# Altium schematic sheet EVK-NORA-B2_SCHEM_0004_SWITCH_Memory.SchDoc
size A3; Date: 7/24/2020; CompanyName: U-blox; DrawnBy: EMOO; Engineer: EMOO; Organization: U-blox; Address1: 3950 Fairview Industrial Dr SE #100*; Address2: Salem, OR 97302; SheetNumber: 4; SheetTotal: 6; SheetSize: B; SheetTitle: Interface MCU
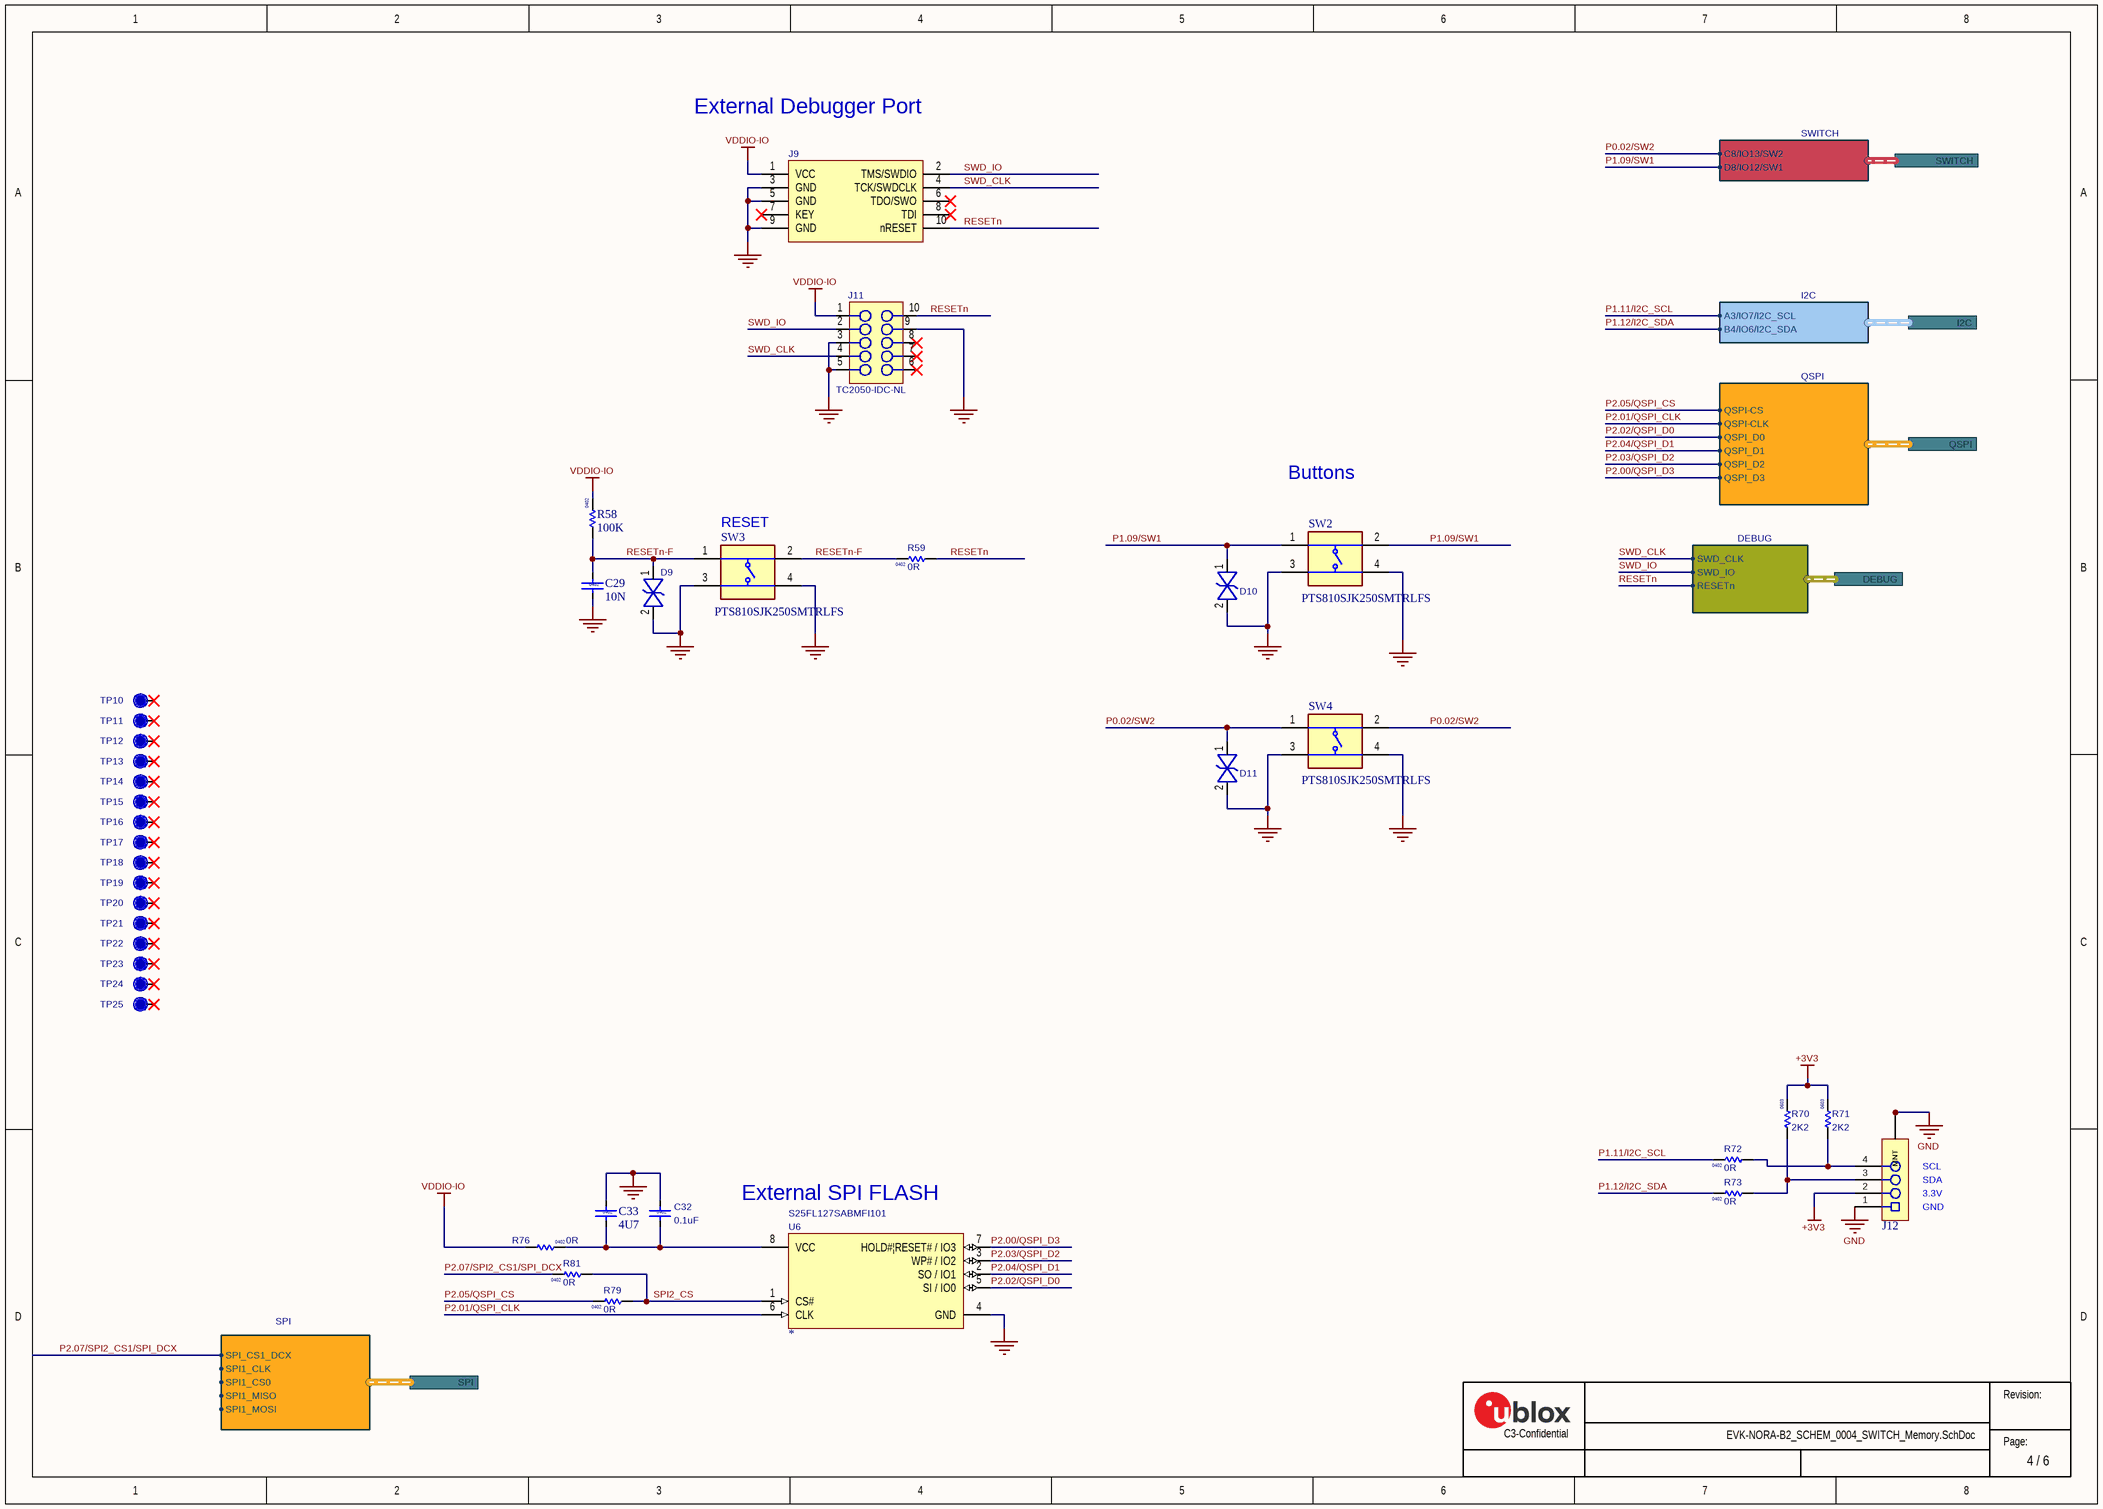
[diagram p0: EVK-NORA-B2_SCHEM_0004_SWITCH_Memory.SchDoc]

## Parts
C29  value 10N  Size: 0402  [Cap_0402_1100Lx600Wx600H_600x600Pad_350G_FLX]
C32  value 0.1uF  Size: 0402  [Cap 0402 HD]  (hidden comment: 120-000160.1uF)
C33  value 4U7  Size: 0402  [Cap 0402 HD]
D9  110-00019  [SOD-923]  (value not drawn)
D10  110-00019  [SOD-923]  (value not drawn)
D11  110-00019  [SOD-923]  (value not drawn)
J9  130-00099  [HDR.050P-10Pin-2x5-SMT_Key]  (value not drawn)
J11  TC2050-IDC-NLDNP  [TC2050-IDC-NL]  (value not drawn)  (no BOM)
J12  UBXH04-0000797  [SM04B-SRSS-TB]  (value not drawn)
R58  value 100K  Size: 0402  [RES_0402_1100Lx600Wx400H_500x600Pad_400G_FLX]
R59  value 0R  Size: 0402  [RES 0402 HD]
R70  value 2K2  Size: 0603  [RES_0603_1700Lx950Wx600H_600x1000Pad_800G_FLX]
R71  value 2K2  Size: 0603  [RES_0603_1700Lx950Wx600H_600x1000Pad_800G_FLX]
R72  value 0R  Size: 0402  [RES 0402 HD]
R73  value 0R  Size: 0402  [RES 0402 HD]
R76  value 0R  Size: 0402  [RES 0402 HD]
R79  value 0R  Size: 0402  [RES 0402 HD]
R81  value 0R  Size: 0402  [RES 0402 HD]
SW2  PTS810SJK250SMTRLFS  [PTS810SJG250SMTRLFS]
SW3  PTS810SJK250SMTRLFS  [PTS810SJG250SMTRLFS]
SW4  PTS810SJK250SMTRLFS  [PTS810SJG250SMTRLFS]
TP10  TP  [TP10R]  (value not drawn)  (no BOM)
TP11  TP  [TP10R]  (value not drawn)  (no BOM)
TP12  TP  [TP10R]  (value not drawn)  (no BOM)
TP13  TP  [TP10R]  (value not drawn)  (no BOM)
TP14  TP  [TP10R]  (value not drawn)  (no BOM)
TP15  TP  [TP10R]  (value not drawn)  (no BOM)
TP16  TP  [TP10R]  (value not drawn)  (no BOM)
TP17  TP  [TP10R]  (value not drawn)  (no BOM)
TP18  TP  [TP10R]  (value not drawn)  (no BOM)
TP19  TP  [TP10R]  (value not drawn)  (no BOM)
TP20  TP  [TP10R]  (value not drawn)  (no BOM)
TP21  TP  [TP10R]  (value not drawn)  (no BOM)
TP22  TP  [TP10R]  (value not drawn)  (no BOM)
TP23  TP  [TP10R]  (value not drawn)  (no BOM)
TP24  TP  [TP10R]  (value not drawn)  (no BOM)
TP25  TP  [TP10R]  (value not drawn)  (no BOM)
U6  Manufacturer Part Number 1: S25FL127SABMFI101  [SOIC-8W]

## Ports
DEBUG (harness Debug), I2C (harness I2C), QSPI (harness QSPI), SPI (harness SPI), SWITCH (harness SWITCH)

## Harnesses
DEBUG: RESETn, SWD_IO, SWD_CLK
QSPI: QSPI-CS, QSPI-CLK, QSPI_D0, QSPI_D1, QSPI_D2, QSPI_D3
I2C: A3/IO7/I2C_SCL, B4/IO6/I2C_SDA
SWITCH: C8/IO13/SW2, D8/IO12/SW1
SPI: SPI_CS1_DCX, SPI1_CLK, SPI1_CS0, SPI1_MISO, SPI1_MOSI

## Nets
+3V3: J12.2 R70.2 R71.2
GND: C29.2 C32.1 C33.1 D9.2 D10.2 D11.2 J9.3(GND) J9.5(GND) J9.9(GND) J11.3 J11.5 J12.1 J12.M1(MNT) J12.M2(MNT) SW2.3 SW2.4 SW3.3 SW3.4 SW4.3 SW4.4 U6.4(GND)
VDDIO-IO: J9.1(VCC) J11.1 R58.2 R76.1
P0.02/SW2: D11.1 SW4.1 SW4.2 ; port SWITCH.C8/IO13/SW2
P1.09/SW1: D10.1 SW2.1 SW2.2 ; port SWITCH.D8/IO12/SW1
P1.11/I2C_SCL: R72.2 ; port I2C.A3/IO7/I2C_SCL
P1.12/I2C_SDA: R73.2 ; port I2C.B4/IO6/I2C_SDA
P2.00/QSPI_D3: U6.7(HOLD#|RESET#_/_IO3) ; port QSPI.QSPI_D3
P2.01/QSPI_CLK: U6.6(CLK) ; port QSPI.QSPI-CLK
P2.02/QSPI_D0: U6.5(SI_/_IO0) ; port QSPI.QSPI_D0
P2.03/QSPI_D2: U6.3(WP#_/_IO2) ; port QSPI.QSPI_D2
P2.04/QSPI_D1: U6.2(SO_/_IO1) ; port QSPI.QSPI_D1
P2.05/QSPI_CS: R79.2 ; port QSPI.QSPI-CS
P2.07/SPI2_CS1/SPI_DCX: R81.2 ; port SPI.SPI_CS1_DCX
RESETn: J9.10(nRESET) J11.10 R59.1 ; port DEBUG.RESETn
RESETn-F: C29.1 D9.1 R58.1 R59.2 SW3.1 SW3.2
SPI2_CS: R79.1 R81.1 U6.1(CS#)
SWD_CLK: J9.4(TCK/SWDCLK) J11.4 ; port DEBUG.SWD_CLK
SWD_IO: J9.2(TMS/SWDIO) J11.2 ; port DEBUG.SWD_IO
NetC32_2: C32.2 C33.2 R76.2 U6.8(VCC)
NetJ12_3: J12.3 R70.1 R73.1
NetJ12_4: J12.4 R71.1 R72.1

Not connected (* = marked no-connect by the designer): J9 6(TDO/SWO)* 7(KEY)* 8(TDI)*; J11 6* 7* 8* 9; TP10 1*; TP11 1*; TP12 1*; TP13 1*; TP14 1*; TP15 1*; TP16 1*; TP17 1*; TP18 1*; TP19 1*; TP20 1*; TP21 1*; TP22 1*; TP23 1*; TP24 1*; TP25 1*

## Notes on the sheet
- External Debugger Port
- Buttons
- (near SW3) RESET
- (near J12) SCL
- (near J12) SDA
- (near U6) External SPI FLASH
- (near J12) GND
- (near J12) 3.3V
- Revision:
- C3-Confidential
- Page:

## Library data of the parts
C29 = UBXH01-0023025: CAP CER X7R 0402 10N 10% 16V; Manufacturer: Murata Manufacturing Company, Ltd.; Manufacturer P/N: GRM155R71C103KA01; Editor: roland.rust; Released by: anthony.gergis; Env: ROHS; Permitted Use: Volume Products; Perferred: PREF; Mfg P/N Status: NRND; Mfg P/N Split: 100; Mfg P/N Released: Yes; Part Number: UBXH01-0023025; Tolerance: 10%; Max Voltage: 16V; Min Operating Temp: -55°C; Max Operating Temp: 125°C; Part Type: Capacitor; Release Data: 2021-02-16T13:14:11; UBX Wiki: https://wiki.u-blox.com/bin/view/Operations/PartDetails?index=5491; RefDes: C; Manufacturer 2: Samsung Electro-Mechanics; Manufacturer P/N 2: CL05B103KO5NNNC; Mfg P/N Status 2: Active; Mfg P/N Split 2: 0; Mfg P/N Released 2: Yes; Mfg P/N Datasheet 2: https://wiki.u-blox.com/bin/view/Generic/Docs/DocumentSummary?index=28567
C32 = 120-00016: Cap, Ceramic 0.1uF 10V 10% X5R 0402; Part Name: CAP CER 0.1UF 10V 10% X5R 0402; Part_Type: Ceramic Capacitor; Manufacturer: Murata Electronics North America; Manufacturer P/N: GRM155R61A104KA01J; Item_Phase: Production; Component Mounting Type: SMT; Tolerance: +/- 10%; Use in new designs: Yes; Part Number: 120-00016; Revision: 0A; Supplier 1: Digi-Key; Supplier Part Number 1: 490-6297-1-ND; Manufacturer 2: Yageo; Manufacturer P/N 2: CC0402KRX5R6BB104; Supplier 2: Digi-Key; Supplier Part Number 2: 311-1336-1-ND; Arena Link: https://app.bom.com/a/GYHPV2L2L43KRMBK?v=spec.summary; Height: 0.55mm; Pins: 2; Temperature Coefficient: X5R; Voltage: 10V
C33 = UBXH01-0000243: CAP CER X5R 0402 4U7 20% 10V; Manufacturer: Murata Manufacturing Company, Ltd.; Manufacturer P/N: GRM155R61A475MEAA; Editor: martin.pilik; Released by: fabrice.bret-dibat; Env: GREEN; Permitted Use: Volume Products; Perferred: PREF; Mfg P/N Status: Active; Mfg P/N Split: 100; Mfg P/N Released: Yes; Part Number: UBXH01-0000243; Tolerance: 20%; Max Voltage: 10V; Min Operating Temp: -40°C; Max Operating Temp: 85°C; Part Type: Capacitor; Release Data: 2021-05-10 12:57:47.325652; UBX Wiki: https://wiki.u-blox.com/bin/view/Operations/PartDetails?index=24303; RefDes: C; Mfg P/N Datasheet: https://wiki.u-blox.com/bin/view/Generic/Docs/DocumentSummary?index=24302
D9-D11 = 110-00019: ESD9B3.3ST5G; Part Name: Diode TVS 3.3V SOD-923; Part_Type: Diode; Manufacturer: ON Semiconductor; Item_Phase: Preliminary; Body Size: 0.8mm x 0.6mm; Component Mounting Type: SMT; Diode Type: TVS; Use in new designs: Yes; Voltage: 3.3V; Part Number: 110-00019; Manufacturer P/N: ESD9B3.3ST5G; Supplier 1: Digi-Key; Supplier Part Number 1: ESD9B3.3ST5GOSCT-ND; Arena Link: https://app.bom.com/a/4M5DJQ9Q9SR7DV4H?v=spec.summary; Height: 0.4mm; MFG Package: SOD-923; Package Type: SOD; Pins: 2
J9 = 130-00099: Header 0.05" 10Pin 2Row SMD Black; Part Name: CON HDR 0.05" 10Pin 2Row SMD Black; Part_Type: Connector; Manufacturer: Samtec; Manufacturer P/N: FTSH-105-01-F-DV-K; Item_Phase: Pre-Production; Component Mounting Type: SMT; Keyed: Yes; Locking: No; Pin Pitch: 0.050"; Rows: 2; Part Number: 130-00099; Revision: 1; Supplier 1: Digi-Key; Supplier Part Number 1: SAM8796-ND; Arena Link: https://app.bom.com/a/5N6EKRARATS7TSHL?v=spec.summary; Color: Black; Connector Type: Header; Height: 6mm; Length: 12.75mm; Pins: 10; Use in new designs: Yes; Width: 4.78
J11 = TC2050-IDC-NL: CON PADS FOR CBL PLUG-OF-NAILS 10-PIN NO LEGS; Manufacturer: TAG Connect; Added By: Paul B; Manufacturer P/N: TC2050-IDC-NL; Part Number: TC2050-IDC-NL; Size: 6.1mm x 9.9mm; Height: 0; DNP: DNP; Added Date: 12/3/2015
J12 = UBXH04-0000797: CONN JST SH SERIES SMT 4 POS MALE 1MM RA 50V 1A; Manufacturer 1: JST Sales America Inc.; Manufacturer Part Number 1: SM04B-SRSS-TB(LF)(SN); Part Name: CONN HEADER SMD R/A 4POS 1MM; Item Phase: In Production; Use in new designs: Yes; Voltage: None; Value: SM04B-SRSS-TB; Editor: eric.moog; Env: ROHS; Permitted Use: Support Products; Perferred: PREF; Mfg P/N Status: Active; Mfg P/N Split: 100; Mfg P/N Released: No; Part Number: UBXH04-0000797; Supplier 1: None; Supplier Part Number 1: None; Diameter: None; Height: 2.9mm; Max Operating Temp: 85°C; Min Operating Temp: -30°C; Pins: 4; Revision: 0A; UBX Code: None; Manufacturer 2: None; Manufacturer Part Number 2: None; Supplier 2: None; Supplier Part Number 2: None; Manufacturer P/N: SM04B-SRSS-TB; Max Voltage: 50V; Max Current: 1A; Part Type: Connector; UBX Wiki: https://wiki.u-blox.com/bin/view/Operations/PartDetails?index=38779; RefDes: J; Manufacturer: JST; Mfg P/N Datasheet: https://wiki.u-blox.com/bin/view/Generic/Docs/DocumentSummary?index=4533
R58 = UBXH18-0008097: RES THICK FILM CHIP 0402 100K 5% 100mW; Manufacturer: YAGEO; Manufacturer P/N: 2322_705_70104_L; Editor: roland.rust; Env: ROHS; Permitted Use: Volume Products; Perferred: PREF; Mfg P/N Status: Obsolete; Mfg P/N Split: 100; Mfg P/N Released: Yes; Part Number: UBXH18-0008097; Tolerance: 5%; Max Power: 100mW; Part Type: Resistor; Released by: roland.rust; Release Data: 2005-07-22T13:59:44; UBX Wiki: https://wiki.u-blox.com/bin/view/Operations/PartDetails?index=7020; RefDes: R; Manufacturer 2: KOA; Manufacturer P/N 2: RK73B1ETTD104J; Mfg P/N Status 2: NRND; Mfg P/N Split 2: 0; Mfg P/N Released 2: Yes
R59 R72 R73 R79 R81 = UBXH18-0003002: RES THICK FILM CHIP 0402 0R 0 100mW; Manufacturer: KOA; Manufacturer P/N: RK73Z1ETTP; Tolerance: 0; Editor: charlotte.biber; Released by: peter.mueller; Env: ROHS; Permitted Use: Volume Products; Perferred: PREF; Mfg P/N Status: NRND; Mfg P/N Split: 100; Mfg P/N Released: Yes; Part Number: UBXH18-0003002; Max Power: 100mW; Part Type: Resistor; Release Data: 2012-06-05 09:49:55.978616; UBX Wiki: https://wiki.u-blox.com/bin/view/Operations/PartDetails?index=6611; RefDes: R; Manufacturer 2: YAGEO; Manufacturer P/N 2: 2322_705_91001_L; Mfg P/N Status 2: NRND; Mfg P/N Split 2: 0; Mfg P/N Released 2: Yes
R70 R71 = UBXH18-0007081: RES THICK FILM CHIP 0603 2K2 5% 100mW; Manufacturer: YAGEO; Manufacturer P/N: 2322_702_81222_L; Editor: roland.rust; Env: ROHS; Permitted Use: Volume Products; Perferred: PREF; Mfg P/N Status: Obsolete; Mfg P/N Split: 100; Mfg P/N Released: Yes; Part Number: UBXH18-0007081; Tolerance: 5%; Max Power: 100mW; Part Type: Resistor; Released by: roland.rust; Release Data: 2007-04-26T15:06:13; UBX Wiki: https://wiki.u-blox.com/bin/view/Operations/PartDetails?index=6711; RefDes: R; Manufacturer 2: YAGEO; Manufacturer P/N 2: RC0603JR-072K2L; Mfg P/N Status 2: Active; Mfg P/N Split 2: 0; Mfg P/N Released 2: Yes; Mfg P/N Datasheet 2: https://wiki.u-blox.com/bin/view/Generic/Docs/DocumentSummary?index=8241
R76 = UBXH18-0003002: RES THICK FILM CHIP 0402 0R 0 100mW; Manufacturer: KOA; Manufacturer P/N: RK73Z1ETTD; Tolerance: 0; Editor: charlotte.biber; Released by: peter.mueller; Env: ROHS; Permitted Use: Volume Products; Perferred: PREF; Mfg P/N Status: NRND; Mfg P/N Split: 100; Mfg P/N Released: Yes; Part Number: UBXH18-0003002; Max Power: 100mW; Part Type: Resistor; Release Data: 2012-06-05 09:49:55.978616; UBX Wiki: https://wiki.u-blox.com/bin/view/Operations/PartDetails?index=6611; RefDes: R; Manufacturer 2: YAGEO; Manufacturer P/N 2: 2322_705_91001_L; Mfg P/N Status 2: NRND; Mfg P/N Split 2: 0; Mfg P/N Released 2: Yes
SW2-SW4 = PTS810SJK250SMTRLFS: Switch; Manufacturer_Name: C & K COMPONENTS; Datasheet Link: https://www.ckswitches.com/media/1476/pts810.pdf; Manufacturer_Part_Number: PTS810SJK250SMTRLFS; Mouser Part Number: 611-PTS810SJK250SMTR; Mouser Price/Stock: https://www.mouser.co.uk/ProductDetail/CK/PTS810SJK250SMTRLFS?qs=UxeAxwACbqlfHzoZSrW3%2Fw%3D%3D
TP10-TP25 = TP10R: Testpoint, Round 1.0mm Dia; Added By: Jeremy D; Part Number: TP10R; Size: 1.0mm; Height: 0; DNP: DNP; Added Date: 2/1/2015; Checked By: Paul B; Checked Date: 2/5/2015
U6 = 240-00017: IC, Flash 128MBIT, 108MHz, 8SOIC; Manufacturer 1: Cypress Semiconductor Corp; Part Name: IC Flash 128MBIT 108MHz 8SOIC; Body Size: 5.28mm x 5.28mm; Interface: SPI; Item Phase: Unreleased; Memory Type: Flash - NOR; MFG Package: 8-SOIC; SMT Pitch: 1.27mm; Thermal Pad: No; Use in new designs: Yes; Voltage: 3.6V; UBX Code: None; Manufacturer P/N: *; Part Number: 240-00017; Supplier 1: Digi-Key; Supplier Part Number 1: 1274-1045-ND; Height: 2.16mm; Memory Size: 128Mbit; Memory Speed: 108MHz; Max Operating Temp: 85; Min Operating Temp: -40; Pins: 8; Revision: None; Manufacturer 2: None; Manufacturer Part Number 2: None; Supplier 2: None; Supplier Part Number 2: None